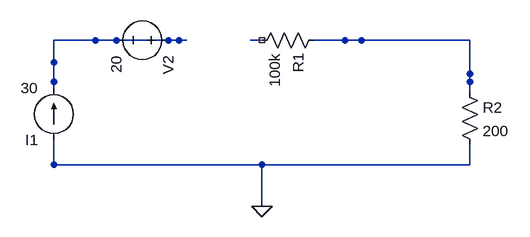
[diagram p0: schematic circuit.asc]
circuit.asc, the LTspice schematic file:
Version 4
SHEET 1 880 680
WIRE 656 320 729 320
WIRE 558 320 574 320
SYMBOL res 672 304 R90
SYMATTR InstName R1
SYMATTR Value 100k
WIRE 896 400 896 372
WIRE 896 512 896 480
SYMBOL res 880 384 R0
SYMATTR InstName R2
SYMATTR Value 200
WIRE 256 474 256 514
WIRE 256 354 256 394
SYMBOL current 256 474 R180
SYMATTR InstName I1
SYMATTR Value 30
FLAG 576 576 0
WIRE 432 320 460 320
WIRE 320 320 352 320
SYMBOL voltage 448 320 R90
SYMATTR InstName V2
SYMATTR Value 20
WIRE 384 320 448 320
WIRE 320 320 384 320
WIRE 576 512 640 512
WIRE 576 512 576 576
WIRE 512 512 576 512
WIRE 768 512 832 512
WIRE 704 512 768 512
WIRE 768 320 832 320
WIRE 704 320 768 320
WIRE 384 512 448 512
WIRE 320 512 384 512
WIRE 896 320 896 384
WIRE 832 320 896 320
WIRE 832 512 896 512
WIRE 256 320 320 320
WIRE 256 320 256 384
WIRE 256 512 320 512
WIRE 448 512 512 512
WIRE 640 512 704 512

The netlist it stands for:
* circuit.asc
R1 N001 NC_01 100k
R2 N001 0 200
I1 0 N003 30
V2 N003 N003 20
.backanno
.end